# EAGLE design attiny_rc_switch_th (EAGLE 9.7.0)
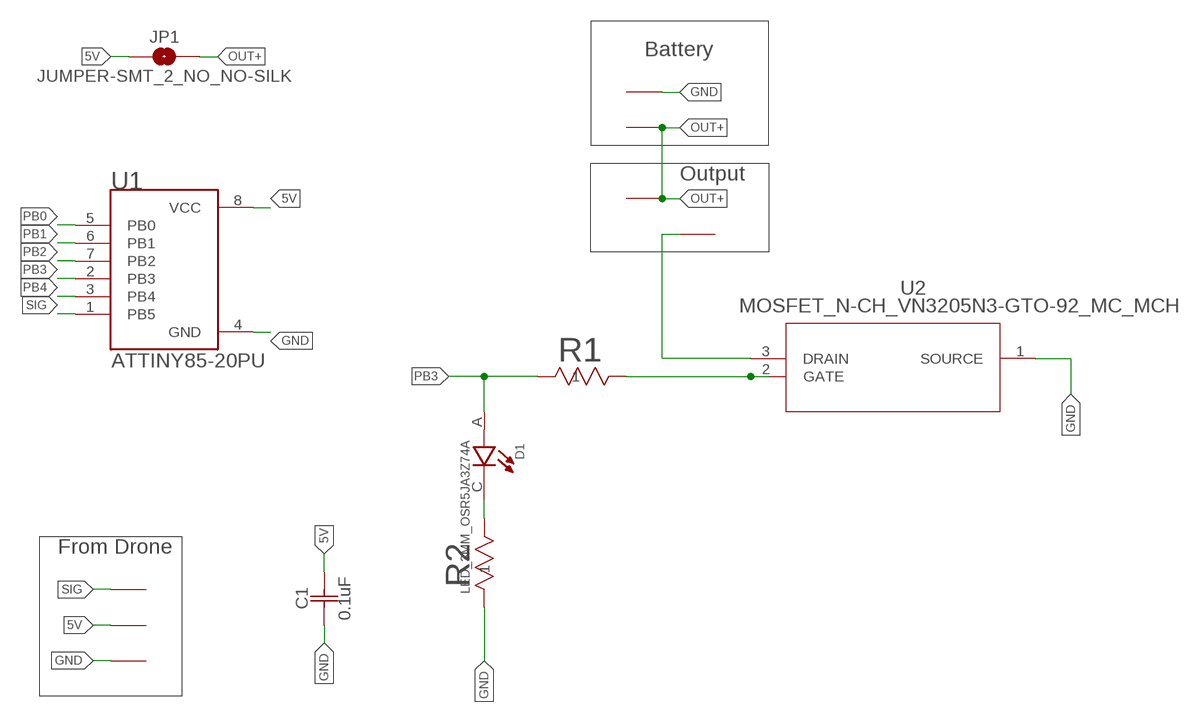
[diagram p0: schematic, sheet 1]

## Parts
C1  0.1uF  CAPACITOR_CERAMIC_50V_K10XK10X7RF5UH5K103K10X7RF5UH5_VIS  [K10XK10X7RF5UH5]
D1  LED_3MM_OSR5JA3Z74A  [OSR5JA3Z74A]
JP1  JUMPER-SMT_2_NO_NO-SILK  [SMT-JUMPER_2_NO_NO-SILK]
R1  RESISTOR_1/8W_CF18JTSTA_CF18_STP  [RESISTOR_1/8W_CF18JT]
R2  RESISTOR_1/8W_CF18JTSTA_CF18_STP  [RESISTOR_1/8W_CF18JT]
U1  ATTINY85-20PU  [ATTINY85-20PU]
U2  MOSFET_N-CH_VN3205N3-GTO-92_MC_MCH  [MOSFET_N-CH_VN3205N3-G]
U$1  SMD_PAD  [SMD_PAD]
U$2  SMD_PAD  [SMD_PAD]
U$3  SMD_PAD  [SMD_PAD]
U$4  SMD_PAD  [SMD_PAD]
U$5  SMD_PAD  [SMD_PAD]
U$6  SMD_PAD  [SMD_PAD]
U$8  SMD_PAD  [SMD_PAD]

## Nets
5V: C1.2 JP1.1 U1.8(VCC) U$1.P$1
GND: C1.1 R2.1 U1.4(GND) U2.1(SOURCE) U$2.P$1 U$4.P$1
N$2: R1.2 U2.2(GATE)
N$3: D1.C R2.2
OUT+: JP1.2 U$3.P$1 U$5.P$1
OUT-: U2.3(DRAIN) U$6.P$1
PB0: U1.5(PB0)
PB1: U1.6(PB1)
PB2: U1.7(PB2)
PB3: D1.A R1.1 U1.2(PB3)
PB4: U1.3(PB4)
SIG: U1.1(PB5) U$8.P$1

## Notes on the sheet
- Battery
- Output
- From Drone

## Library data of the parts
C1 = scotts-library:CAPACITOR_CERAMIC_50V_K10XK10X7RF5UH5; COPYRIGHT: Copyright (C) 2024 Ultra Librarian. All rights reserved.; MANUFACTURER_PART_NUMBER: K103K10X7RF5UH5; MFR_NAME: Vishay; TYPE: Ceramic Capacitor
D1 = scotts-library:LED_3MM_OSR5JA3Z74A: Check availability <https://pricing.snapeda.com/parts/OSR5JA3Z74A/optosupply/view-part?ref=eda>; AVAILABILITY: In Stock; CHECK_PRICES: https://www.snapeda.com/parts/OSR5JA3Z74A/OptoSupply/view-part/?ref=eda; DESCRIPTION: LED; 3mm; red; 220÷330mcd; 70°; Front: convex; Pitch: 2.54mm; MF: optosupply; MP: OSR5JA3Z74A; PACKAGE: None; PRICE: None; SNAPEDA_LINK: https://www.snapeda.com/parts/OSR5JA3Z74A/OptoSupply/view-part/?ref=snap
JP1 = SparkFun-Jumpers:JUMPER-SMT_2_NO: Normally open jumper This jumper has two pads in close proximity to each other. Apply solder to close the connection. Round pads are easier to solder for beginners, but are a lot larger. SparkFun Product that uses the round pads: SparkFun EL Sequencer <https://www.sparkfun.com/products/12781>
R1 R2 = scotts-library:RESISTOR_1/8W_CF18JT; COPYRIGHT: Copyright (C) 2025 Ultra Librarian. All rights reserved.; MANUFACTURER_PART_NUMBER: CF18JT100K; MFR_NAME: Stackpole International
U1 = scotts-library:ATTINY85-20PU; MANUFACTURER: Atmel
U2 = scotts-library:MOSFET_N-CH_VN3205N3-G; COPYRIGHT: Copyright (C) 2025 Ultra Librarian. All rights reserved.; MANUFACTURER_PART_NUMBER: VN3205N3-G; MFR_NAME: Microchip
U$1-U$6 U$8 = scotts-library:SMD_PAD

## Board
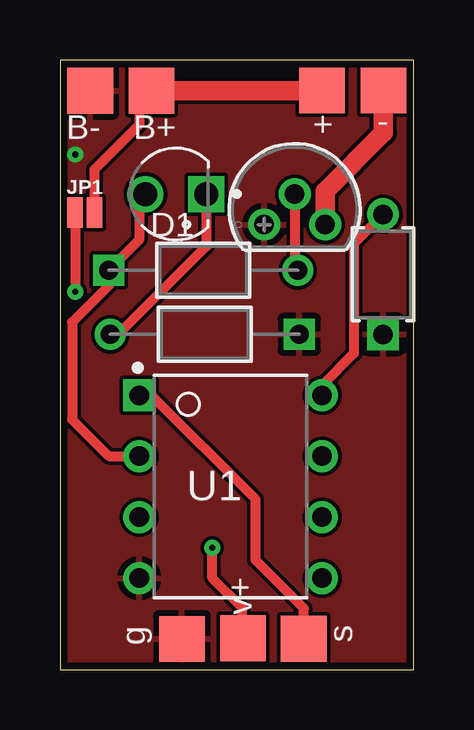
[diagram p1: board, top side]
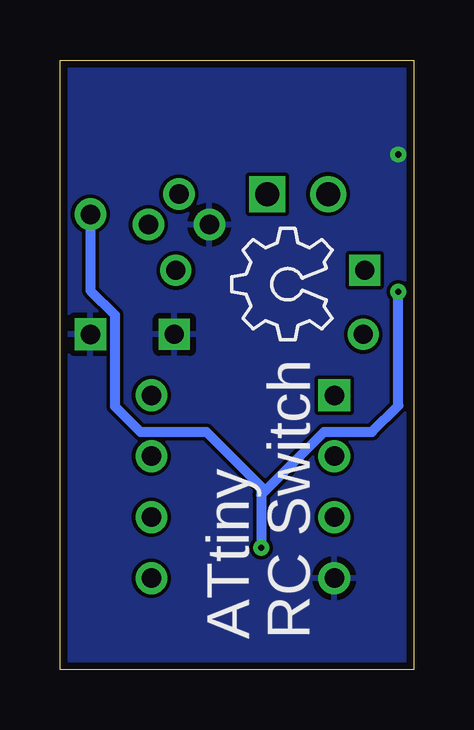
[diagram p2: board, bottom side, seen from below]

Size 14.73 x 25.4 mm. Coordinates in mm from the lower left corner, seen from the top.
Outline: 0,0 14.73,0 14.73,25.4 0,25.4 0,0
Copper layers (1*16): Top 0.035mm / dielectric 1.5mm / Bottom 0.035mm
Design rules "Fusion Electronics Design Rules *": minimum track width 6mil, minimum drill 10mil, track to track 6mil, track to pad 6mil, pad to pad 6mil, via to via 6mil, smd to smd 6mil, copper to edge 12mil, drill to drill 6mil, minimum pad ring 10mil, minimum via ring 8mil, stop-mask expansion 4mil, vias tented up to drill 0mil, thermal gap 10mil

### Footprints (pad centres in the part's own frame; a part is rotated, then mirrored left to right if it is on the bottom)
K10XK10X7RF5UH5 = drill 0.813 pad 1.321 square: 1 0,0 | drill 0.813 pad 1.321: 2 5,0
OSR5JA3Z74A = drill 1 pad 1.5: A 1.27,0 | drill 1 pad 1.5 square: C -1.27,0
SMT-JUMPER_2_NO_NO-SILK = smd 0.635 x 1.27: 1 -0.406,0; 2 0.406,0
RESISTOR_1/8W_CF18JT = drill 0.787 pad 1.295 square: 1 0,0 | drill 0.787 pad 1.295: 2 7.874,0
ATTINY85-20PU = drill 0.813 square: 1 -3.81,3.81 | drill 0.813: 2 -3.81,1.27; 3 -3.81,-1.27; 4 -3.81,-3.81; 5 3.81,-3.81; 6 3.81,-1.27; 7 3.81,1.27; 8 3.81,3.81
MOSFET_N-CH_VN3205N3-G = drill 0.813 pad 1.321: 1 0,0; 2 1.27,1.27; 3 2.54,0
SMD_PAD = smd 1.905 x 1.905: P$1 0,0

### Placement (x,y rotation side)
C1  13.46,13.97 90 top
D1  4.83,19.81 180 top
JP1  1.03,19.05 0 top
R1  2.03,16.64 0 top
R2  9.97,13.97 180 top
U1  7.11,7.62 0 top
U2  8.51,18.54 0 top
U$1  7.62,1.3 270 top
U$2  5.08,1.28 270 top
U$3  3.81,24.12 0 top
U$4  1.26,24.12 0 top
U$5  10.92,24.13 0 top
U$6  13.47,24.13 0 top
U$8  10.16,1.28 270 top

### Tracks (layer width: path | path; a pad name or v marks a point on that pad's centre or on a via)
5V  (via drill 0.25 pad 0.61)
  Top 0.406: U$1.P$1 7.59,1.3 7.59,2.57 6.35,3.81 v6.35,5.08 | v0.64,15.75 0.64,18.53 0.62,18.54 JP1.1 | C1.2 12.24,17.75 12.24,13.18 10.92,11.85 U1.8
  Bottom 0.406: 6.35,7.28 6.35,7.62 8.64,9.91 11.38,9.91 12.45,10.97 12.45,14.78 13.46,15.79 C1.2 | 6.35,7.28 v6.35,5.08 | v0.64,15.75 0.64,11 1.73,9.91 3.72,9.91 6.35,7.28
GND  (via drill 0.25)
  other vias: 0.64,21.46
  pour Top: 0.08,0.08 15.16,0.08 15.16,25.32 0.08,25.32
  pour Bottom: 0.08,0.08 15.16,0.08 15.16,25.32 0.08,25.32
N$2
  Top 0.406: U2.2 9.78,16.76 R1.2
N$3
  Top 0.406: R2.2 2.43,13.97 6.1,17.63 D1.C
OUT+
  Top 0.406: U$3.P$1 3.3,23.61 3.3,22.7 1.44,20.83 JP1.2
  Top 0.61: U$5.P$1 10.91,24.12
  Top 0.813: 10.91,24.12 U$3.P$1
OUT-
  Top 0.813: U2.3 11.05,19.94 13.47,22.36 U$6.P$1
PB3
  Top 0.406: U1.2 2.03,8.89 0.51,10.41 0.51,14.48 2.03,16 R1.1 3.3,17.91 3.3,19.18 3.56,19.43 D1.A
SIG
  Top 0.406: U1.1 3.81,11.43 8.15,7.09 8.15,4.57 10.16,2.55 U$8.P$1

### Text on the board
tPlace: B- | B+ | + | - | v+ | g | s
bPlace: RC Switch | ATtiny